# Altium schematic sheet POWER.SchDoc: MISKO 3.0
size A4; Date: 19.9.2021; Author: AMADEJ PAPEŽ; SheetNumber: 3; SheetTotal: 13; Version: V1.1; SheetTitle: POWER
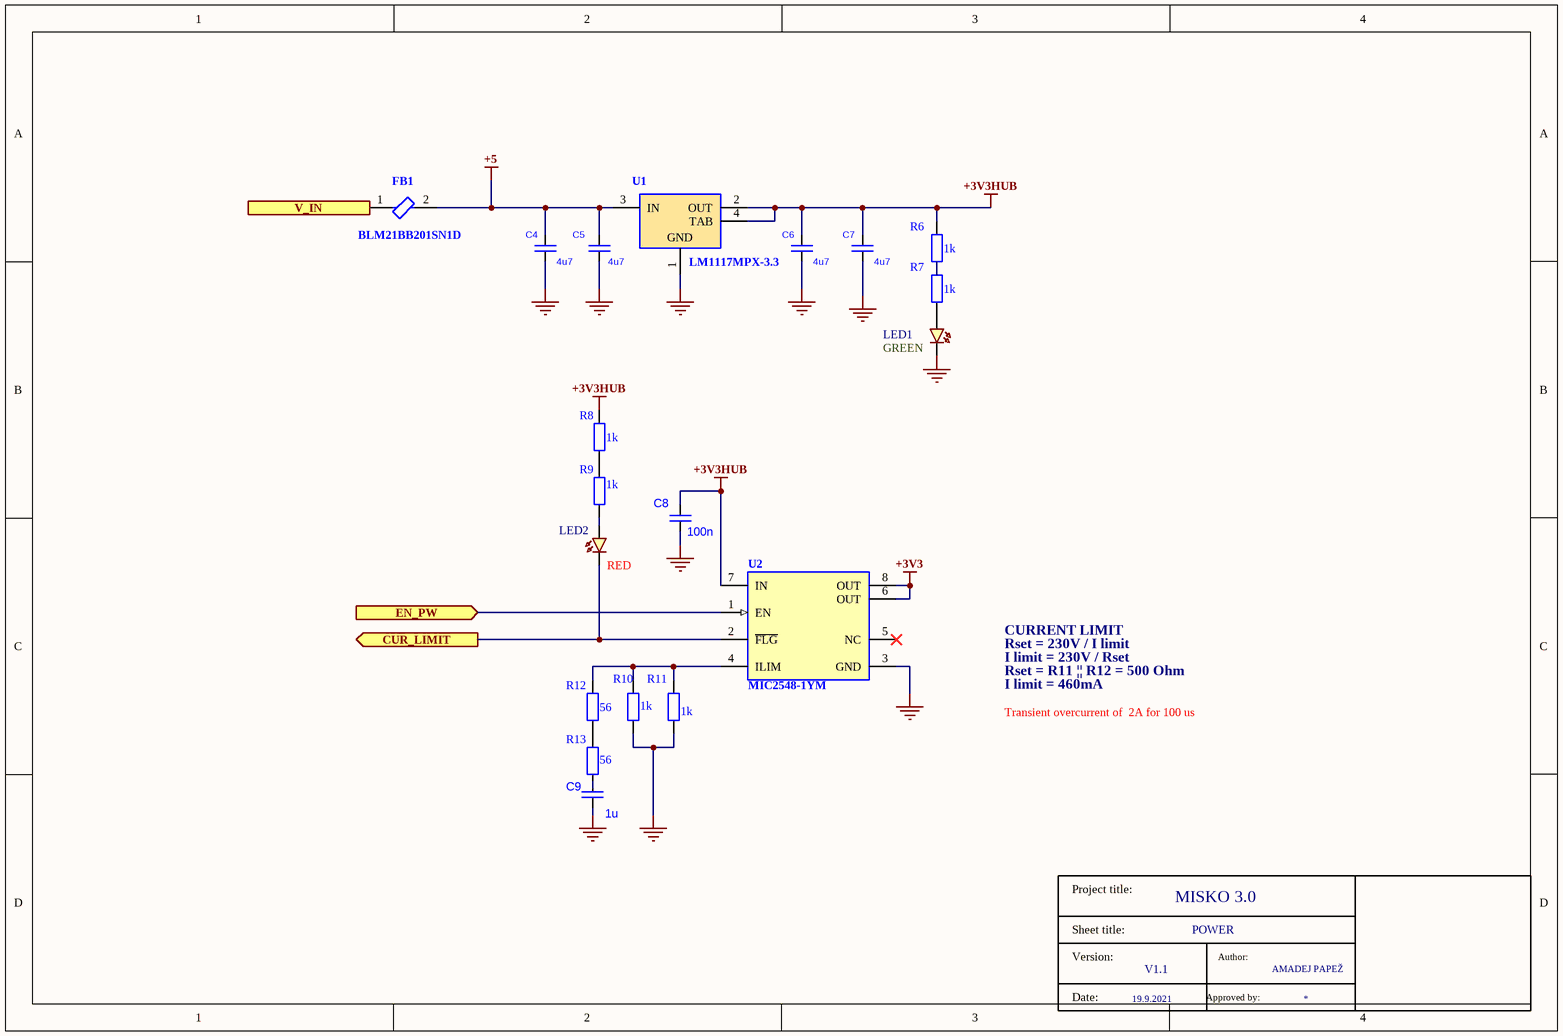
[diagram p0: POWER.SchDoc]

## Parts
C4  value 4u7  [C0603]
C5  value 4u7  [C0603]
C6  value 4u7  [C0603]
C7  value 4u7  [C0603]
C8  value 100n  [C0603]
C9  value 1u  [C0603]
FB1  BLM21BB201SN1D  [BLM2102FB0805]
LED1  GREEN  [LED0603]
LED2  RED  [LED0603]
R6  value 1k  [R1608_0603I_L]
R7  value 1k  [R1608_0603I_L]
R8  value 1k  [R1608_0603I_L]
R9  value 1k  [R1608_0603I_L]
R10  value 1k  [R1608_0603I_L]
R11  value 1k  [R1608_0603I_L]
R12  value 56  [R1608_0603I_L]
R13  value 56  [R1608_0603I_L]
T3  (no value)
U1  LM1117MPX-3.3  [DCY0004A_M]
U2  MIC2548-1YM  [SOIC_8_MIC2544]

## Ports
CUR_LIMIT (out), EN_PW (in), V_IN (in)

## Nets
+3V3: U2.6(OUT) U2.8(OUT)
+3V3HUB: C6.2 C7.2 C8.2 R6.1 R8.2 U1.2(OUT) U1.4(TAB) U2.7(IN)
+5: C4.2 C5.2 FB1.2 U1.3(IN)
GND: C4.1 C5.1 C6.1 C7.1 C8.1 C9.1 LED1.1(KATODE) R10.1 R11.1 U1.1(GND) U2.3(GND)
CUR_LIMIT: LED2.1(KATODE) U2.2(~{FLG}) ; port CUR_LIMIT
EN_PW: U2.1(EN) ; port EN_PW
V_IN: FB1.1 ; port V_IN
NetC9_2: C9.2 R13.1
NetLED1_2: LED1.2(ANODE) R7.2
NetLED2_2: LED2.2(ANODE) R9.1
NetR6_2: R6.2 R7.1
NetR8_1: R8.1 R9.2
NetR10_2: R10.2 R11.2 R12.2 U2.4(ILIM)
NetR12_1: R12.1 R13.2

Not connected (* = marked no-connect by the designer): U2 5(NC)*

## Notes on the sheet
- Rset = 230V / I limit
- CURRENT LIMIT
- I limit = 230V / Rset
- Rset = R11 || R12 = 500 Ohm
- I limit = 460mA
- Transient overcurrent of  2A for 100 us
- (in symbol Title block) Project title:; Sheet title:; Version:; Author:; Date:; Approved by:

## Library data of the parts
C4-C7 = C: Capacitor; Code: NB7-4U7-25V
C8 = C: Capacitor; Code: NB6-100N
C9 = C: Capacitor; Code: NB7-1U-25V
FB1 = BLM21BB201SN1D: Chip Ferrite Bead, 0805, 200Ω @ 100MHz, 0.26Ω, 25%, 500mA; Number of Circuits: 1; Shielding: Unshielded; DC Resistance (DCR): 260mR; Material: Steel; DC Resistance-Max: 350mR; Impedance: 200R; Max DC Current: 200mA; Code: LZ-FB0805; Max Operating Temperature: 125°C; Packaging: Tape and Reel; REACH SVHC: No SVHC; Depth: 1.25mm; Core Material: Ferrite; Case Code (Metric): 2012; Termination: SMD/SMT; Series: BLM21B; Number of Lines: 1; Max Current Rating: 500mA; Package Quantity: 4000; Lead Free: Lead Free; Test Frequency: 100MHz; Case Code (Imperial): 0805; Number of Pins: 2; Height: 0.85mm; Tolerance: 25%; Width: 1.25mm; Case/Package: 0805; Min Operating Temperature: -55°C; Current Rating: 500mA; Length: 2mm
LED1 = LED: Green light-emitting diode; Code: KLC-G
LED2 = LED: Red light-emitting diode; Code: KLC-R
R6-R11 = R: Code: LC4-1K
R12 R13 = R: Code: LC2-56E
T3 = Title block
U1 = LM1117MPX-3.3: 800mA Low-Dropout Linear Regulator, 4-pin SOT-223, Pb-Free / DataSheet: / https://www.ti.com/lit/ds/symlink/lm1117.pdf?ts=1629838143263&ref_url=https%253A%252F%252Fwww.google.com%252F; PartNumber: LM1117MPX-3.3/NOPB; Manufacturer: Texas Instruments; High-Reliability: Y; PowerWise: N; PackageTopMarking: XYTT*N05A; CompType: LDO IC; Code: FRL-33-LM1117; ComponentLink1URL: http://www.ti.com/general/docs/lit/getliterature.tsp?genericPartNumber=LM1117-N&fileType=pdf; ComponentLink1Description: Datasheet URL; PinCount: 4; Code_JEDEC: TO-261-AA; PackageDescription: Molded SOT-223, 6.50 x 3.56 x 1.6mm Body, 4 Lead, 2.3mm Pitch; PackageReference: DCY0004A; RoHS: Y; Code_IPC: SOT223-4
U2 = MIC2544-1YM: IC PWR SWITCH N-CHAN 1:1 8MSOP / DataSheet: / https://ww1.microchip.com/downloads/en/DeviceDoc/20005725B.pdf; Manufacturer Part Number: MIC2544-1YMM-TR; Turn-On Delay Time: 5ms; Interface: On/Off; Output Configuration: High Side; Rated Current-Max: 1.5A; Number of Switches: 1; Min Supply Voltage: 2.7V; On-state Resistance-Max: 120MR; Nominal Supply Current: 5uA; Fault Protection: Over Temperature; Turn-Off Delay Time: 22us; Max Supply Voltage: 5.5V; Code: FS-MIC2544; Max Operating Temperature: 85°C; Series: -; Package Quantity: 2500; On-State Resistance: 120mR; Max Output Current: 1.5A; Radiation Hardening: No; Case/Package: MSOP; Min Operating Temperature: -40°C; Number of Outputs: 1; Current Rating: 1.5A; Mount: Surface Mount; Number of Pins: 8; Supply Current: 5uA; Packaging: Tape and Reel; Manufacturer: Microchip